# EAGLE design Sensor Board (EAGLE 9.6.2)
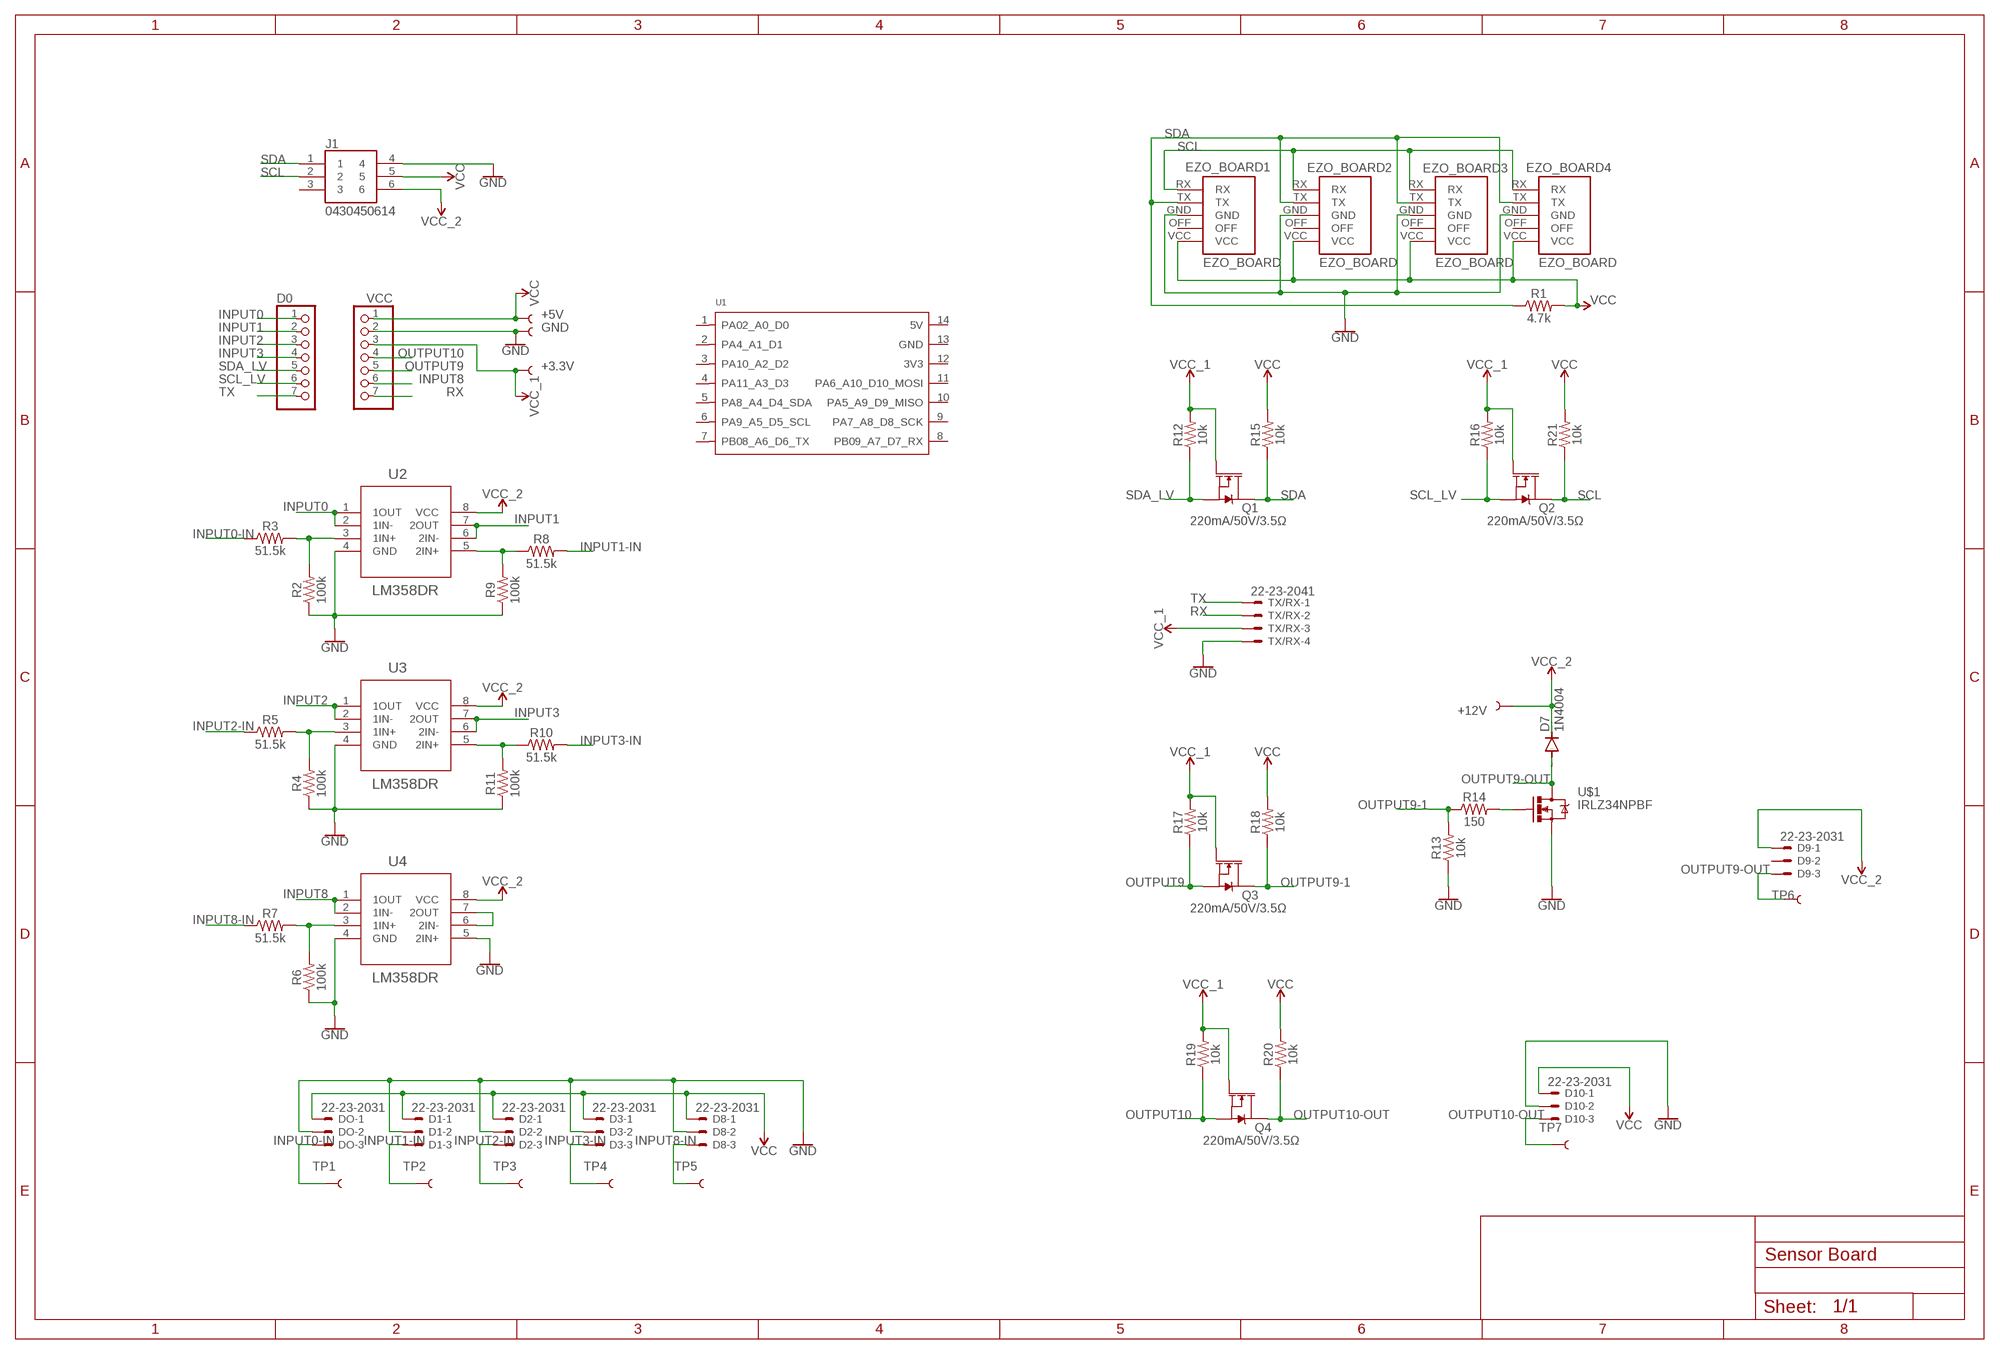
[diagram p0: schematic, sheet 1]

## Parts
+3.3V  TEST-POINTPOGO_PTH  [1X01_NO_SILK]
+5V  TEST-POINTPOGO_PTH  [1X01_NO_SILK]
+12V  TEST-POINTPOGO_PTH  [1X01_NO_SILK]
D0  PINHD-1X7  [1X07]
D1  22-23-2031  [22-23-2031]
D2  22-23-2031  [22-23-2031]
D3  22-23-2031  [22-23-2031]
D7  1N4004  [DO41-10]
D8  22-23-2031  [22-23-2031]
D9  22-23-2031  [22-23-2031]
D10  22-23-2031  [22-23-2031]
DO  22-23-2031  [22-23-2031]
EZO_BOARD1  EZO_BOARD  [EZO_BOARD]
EZO_BOARD2  EZO_BOARD  [EZO_BOARD]
EZO_BOARD3  EZO_BOARD  [EZO_BOARD]
EZO_BOARD4  EZO_BOARD  [EZO_BOARD]
GND  TEST-POINTPOGO_PTH  [1X01_NO_SILK]
J1  0430450614  [MOLEX_0430450614]
Q1  220mA/50V/3.5Ω  MOSFET-NCH-BSS138  [SOT23-3]
Q2  220mA/50V/3.5Ω  MOSFET-NCH-BSS138  [SOT23-3]
Q3  220mA/50V/3.5Ω  MOSFET-NCH-BSS138  [SOT23-3]
Q4  220mA/50V/3.5Ω  MOSFET-NCH-BSS138  [SOT23-3]
R1  4.7k  4.7KOHM-0603-1/10W-1%  [0603]
R2  100k  100KOHM-0603-1/10W-1%  [0603]
R3  51.5k  56KOHM  [0603]
R4  100k  100KOHM-0603-1/10W-1%  [0603]
R5  51.5k  56KOHM  [0603]
R6  100k  100KOHM-0603-1/10W-1%  [0603]
R7  51.5k  56KOHM  [0603]
R8  51.5k  56KOHM  [0603]
R9  100k  100KOHM-0603-1/10W-1%  [0603]
R10  51.5k  56KOHM  [0603]
R11  100k  100KOHM-0603-1/10W-1%  [0603]
R12  10k  10KOHM-0603-1/10W-1%  [0603]
R13  10k  10KOHM-0603-1/10W-1%  [0603]
R14  150  150OHM-0603-1/10W-1%  [0603]
R15  10k  10KOHM-0603-1/10W-1%  [0603]
R16  10k  10KOHM-0603-1/10W-1%  [0603]
R17  10k  10KOHM-0603-1/10W-1%  [0603]
R18  10k  10KOHM-0603-1/10W-1%  [0603]
R19  10k  10KOHM-0603-1/10W-1%  [0603]
R20  10k  10KOHM-0603-1/10W-1%  [0603]
R21  10k  10KOHM-0603-1/10W-1%  [0603]
TP1  TEST-POINT2  [PAD.02X.02]
TP2  TEST-POINT2  [PAD.02X.02]
TP3  TEST-POINT2  [PAD.02X.02]
TP4  TEST-POINT2  [PAD.02X.02]
TP5  TEST-POINT2  [PAD.02X.02]
TP6  TEST-POINT2  [PAD.02X.02]
TP7  TEST-POINT2  [PAD.02X.02]
TX/RX  22-23-2041  [22-23-2041]
U1  MOUDLE-SEEEDUINO-XIAO  [MOUDLE14P-2.54-21X17.8MM]
U2  LM358DR  [D8]
U3  LM358DR  [D8]
U4  LM358DR  [D8]
U$1  IRLZ34NPBF  [TO-220(2)]
VCC  PINHD-1X7  [1X07]

## Nets
GND: D1.2 D2.2 D3.2 D8.2 D10.2 DO.2 EZO_BOARD1.GND EZO_BOARD2.GND EZO_BOARD3.GND EZO_BOARD4.GND GND.1 J1.4 R2.1 R4.1 R6.1 R9.1 R11.1 R13.1 TX/RX.4 U2.4(GND) U3.4(GND) U4.4(GND) U4.5(2IN+) U$1.OUT(S) VCC.2
INPUT0: D0.1 U2.1(1OUT) U2.2(1IN-)
INPUT0-IN: DO.3 R3.1 TP1.1
INPUT1: D0.2 U2.6(2IN-) U2.7(2OUT)
INPUT1-IN: D1.3 R8.2 TP2.1
INPUT2: D0.3 U3.1(1OUT) U3.2(1IN-)
INPUT2-IN: D2.3 R5.1 TP3.1
INPUT3: D0.4 U3.6(2IN-) U3.7(2OUT)
INPUT3-IN: D3.3 R10.2 TP4.1
INPUT8: U4.1(1OUT) U4.2(1IN-) VCC.6
INPUT8-IN: D8.3 R7.1 TP5.1
N$1: R2.2 R3.2 U2.3(1IN+)
N$2: R4.2 R5.2 U3.3(1IN+)
N$3: R6.2 R7.2 U4.3(1IN+)
N$4: R8.1 R9.2 U2.5(2IN+)
N$6: U4.6(2IN-) U4.7(2OUT)
N$7: R10.1 R11.2 U3.5(2IN+)
N$11: R14.2 U$1.IN(G)
OUTPUT9: Q3.2(S) R17.1 VCC.5
OUTPUT9-1: Q3.3(D) R13.2 R14.1 R18.1
OUTPUT9-OUT: D7.A D9.3 TP6.1 U$1.GND(D)
OUTPUT10: Q4.2(S) R19.1 VCC.4
OUTPUT10-OUT: D10.3 Q4.3(D) R20.1 TP7.1
RX: TX/RX.2 VCC.7
SCL: EZO_BOARD1.RX EZO_BOARD2.RX EZO_BOARD3.RX EZO_BOARD4.RX J1.2 Q2.3(D) R21.1
SCL_LV: D0.6 Q2.2(S) R16.1
SDA: EZO_BOARD1.TX EZO_BOARD2.TX EZO_BOARD3.TX EZO_BOARD4.TX J1.1 Q1.3(D) R1.1 R15.1
SDA_LV: D0.5 Q1.2(S) R12.1
TX: D0.7 TX/RX.1
VCC: +5V.1 D1.1 D2.1 D3.1 D8.1 D10.1 DO.1 EZO_BOARD1.VCC EZO_BOARD2.VCC EZO_BOARD3.VCC EZO_BOARD4.VCC J1.5 R1.2 R15.2 R18.2 R20.2 R21.2 VCC.1
VCC_1: +3.3V.1 Q1.1(G) Q2.1(G) Q3.1(G) Q4.1(G) R12.2 R16.2 R17.2 R19.2 TX/RX.3 VCC.3
VCC_2: +12V.1 D7.C D9.1 J1.6 U2.8(VCC) U3.8(VCC) U4.8(VCC)
Unconnected: D9.2 EZO_BOARD1.OFF EZO_BOARD2.OFF EZO_BOARD3.OFF EZO_BOARD4.OFF J1.3 U1.1(PA02_A0_D0) U1.2(PA4_A1_D1) U1.3(PA10_A2_D2) U1.4(PA11_A3_D3) U1.5(PA8_A4_D4_SDA) U1.6(PA9_A5_D5_SCL) U1.7(PB08_A6_D6_TX) U1.8(PB09_A7_D7_RX) U1.9(PA7_A8_D8_SCK) U1.10(PA5_A9_D9_MISO) U1.11(PA6_A10_D10_MOSI) U1.12(3V3) U1.13(GND) U1.14(5V)

## Library data of the parts
+3.3V +5V +12V GND TP1-TP7 = SparkFun-Connectors:TEST-POINT: SparkFun Test Points Bare copper test points for troubleshooting or In-Circuit-Testing. These are used by our Production team for verifying production board runs using pogo-pins on test beds. SparkFun Products: SparkFun LSM9DS1 Breakout <https://www.sparkfun.com/products/13284> SparkFun PSOC <https://www.sparkfun.com/products/13714> SparkFun Load Cell Amplifier <https://www.sparkfun.com/products/13879>
D0 VCC = pinhead:PINHD-1X7: PIN HEADER
D1-D3 D8-D10 DO = con-molex:22-23-2031: .100" (2.54mm) Center Header - 3 Pin; MF: MOLEX; MPN: 22-23-2031; OC_FARNELL: 1462950; OC_NEWARK: 30C0862
D7 = diode:1N4004: DIODE general purpose rectifier, 1 A
EZO_BOARD1-EZO_BOARD4 = EZO Board Atlas Scientific:EZO_BOARD
J1 = 0430450614:0430450614: Conn Power HDR 6 POS 3mm Solder ST Thru-Hole 6 Terminal 1 Port Micro-Fit 3.0Ã¢â¢ Tray; AVAILABILITY: Unavailable; DESCRIPTION: Connector Header Through Hole 6 position 0.118 _3.00mm_; MF: Molex; MP: 0430450614; PACKAGE: None; PRICE: None
Q1-Q4 = SparkFun-DiscreteSemi:MOSFET-NCH: N-channel MOSFETs Voltage controlled devices that allow control of high current outputs. SparkFun Products: SparkFun OpenScale <https://www.sparkfun.com/products/13261> SparkFun Digital Sandbox <https://www.sparkfun.com/products/12651> SparkFun Monster Moto Shield <https://www.sparkfun.com/products/10182> SparkFun MOSFET Power Controller <https://www.sparkfun.com/products/11214>; PROD_ID: TRANS-00830
R1 = SparkFun-Resistors:4.7KOHM: 4.7kΩ resistor A resistor is a passive two-terminal electrical component that implements electrical resistance as a circuit element. Resistors act to reduce current flow, and, at the same time, act to lower voltage levels within circuits. - Wikipedia; PROD_ID: RES-07857
R2 R4 R6 R9 R11 = SparkFun-Resistors:100KOHM: 100kΩ resistor A resistor is a passive two-terminal electrical component that implements electrical resistance as a circuit element. Resistors act to reduce current flow, and, at the same time, act to lower voltage levels within circuits. - Wikipedia; PROD_ID: RES-07828
R3 R5 R7 R8 R10 = SparkFun-Resistors:56KOHM; VALUE: 56k
R12 R13 R15-R21 = SparkFun-Resistors:10KOHM: 10kΩ resistor A resistor is a passive two-terminal electrical component that implements electrical resistance as a circuit element. Resistors act to reduce current flow, and, at the same time, act to lower voltage levels within circuits. - Wikipedia; PROD_ID: RES-00824
R14 = SparkFun-Resistors:150OHM: 150Ω resistor A resistor is a passive two-terminal electrical component that implements electrical resistance as a circuit element. Resistors act to reduce current flow, and, at the same time, act to lower voltage levels within circuits. - Wikipedia; PROD_ID: RES-11028
TX/RX = con-molex:22-23-2041: .100" (2.54mm) Center Header - 4 Pin; MF: MOLEX; MPN: 22-23-2041; OC_FARNELL: 1462920; OC_NEWARK: 38C0355
U1 = Seeeduino XIAO:MOUDLE-SEEEDUINO-XIAO
U2-U4 = LM358DR:LM358DR; BUILT_BY: EMA_UL_Team; MANUFACTURER: Texas Instruments; MANUFACTURER_PART_NUMBER: LM358DR; VENDOR: Vendor
U$1 = IRLZ34NPBF:IRLZ34NPBF; DESCRIPTION: N-Channel 55V 30A _Tc_ 68W _Tc_ Through Hole TO-220AB; DIGI-KEY_PART_NUMBER: IRLZ34NPBF-ND; MF: Infineon Technologies; MP: IRLZ34NPBF; PACKAGE: TO-220 Infineon

## Board
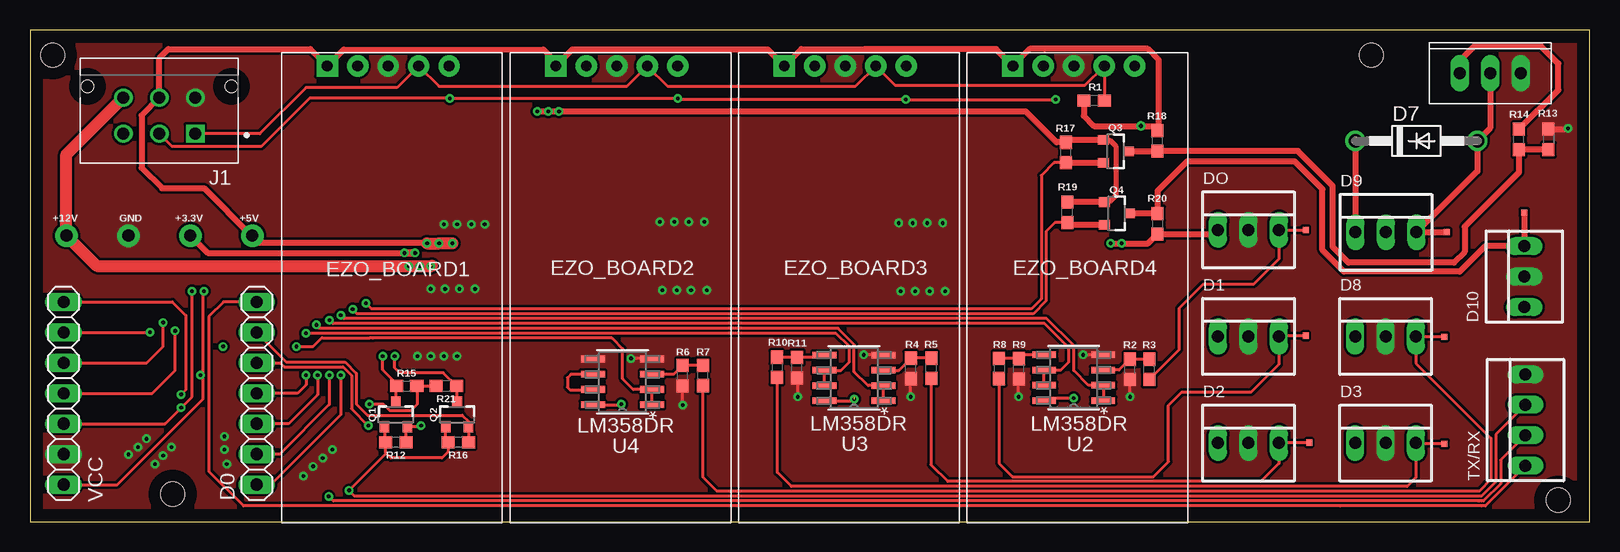
[diagram p1: board, top side]
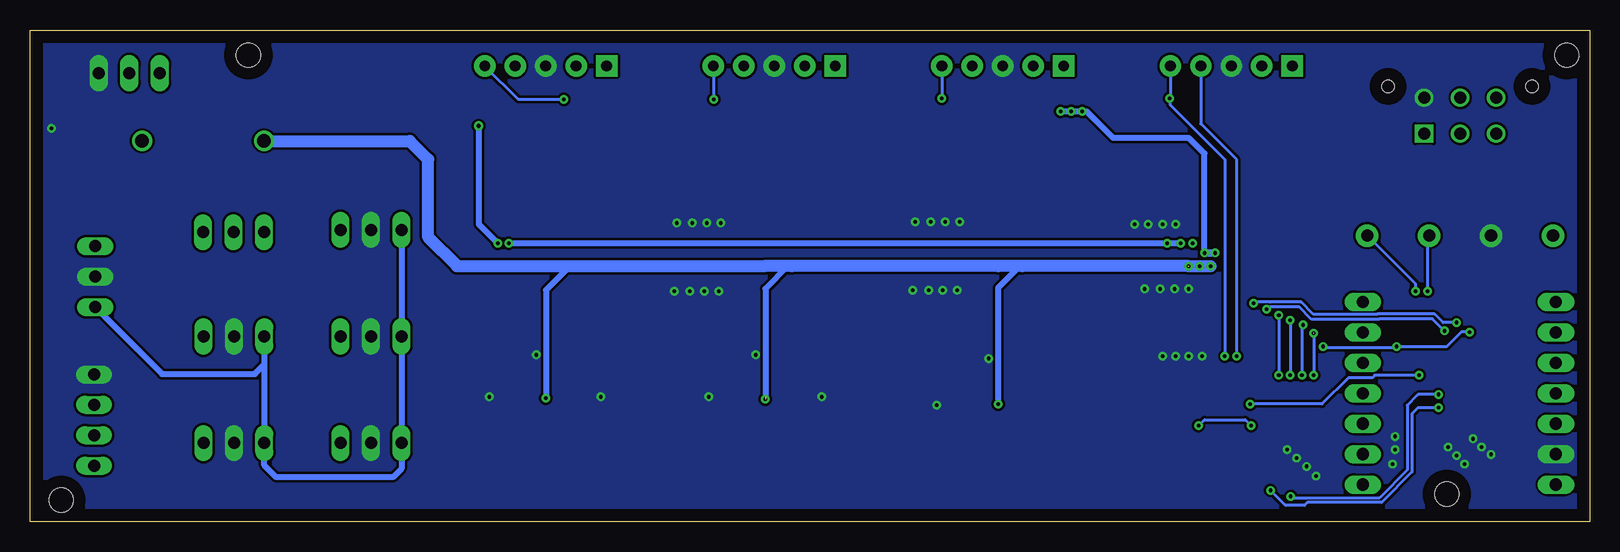
[diagram p2: board, bottom side, seen from below]

Size 130 x 41 mm. Coordinates in mm from the lower left corner, seen from the top.
Outline: 0,0 130,0 130,41 0,41 0,0
Copper layers (1*16): Top 0.035mm / dielectric 1.5mm / Bottom 0.035mm
Design rules "default *": minimum track width 6mil, minimum drill 0.35mm, track to track 6mil, track to pad 6mil, pad to pad 6mil, via to via 6mil, smd to smd 6mil, copper to edge 40mil, drill to drill 6mil, minimum pad ring 10mil, minimum via ring 8mil, stop-mask expansion 4mil, vias tented up to drill 0.3mm, thermal gap 10mil
Holes 2 mm at 1.9,38.9 11.9,2.3 127.4,1.8 111.8,38.9

### Footprints (pad centres in the part's own frame; a part is rotated, then mirrored left to right if it is on the bottom)
1X01_NO_SILK = drill 1.016 pad 1.88: 1 0,0
1X07 = drill 1.016 long: 1 -7.62,0; 2 -5.08,0; 3 -2.54,0; 4 0,0; 5 2.54,0; 6 5.08,0; 7 7.62,0
22-23-2031 = drill 1 long: 1 -2.54,0; 2 0,0; 3 2.54,0
DO41-10 = drill 1.118: A 5.08,0; C -5.08,0
EZO_BOARD = drill 0.9 pad 1.778: GND 8.89,38.1; OFF 6.35,38.1; RX 13.97,38.1; TX 11.43,38.1 | drill 0.9 pad 1.778 square: VCC 3.81,38.1
MOLEX_0430450614 = drill 1.02 square: 1 -3,1.5 | drill 1.02: 2 0,1.5; 3 3,1.5; 4 -3,-1.5; 5 0,-1.5; 6 3,-1.5 | hole 1.02: 6,-2.44; -6,-2.44
SOT23-3 = smd 0.8 x 0.9: 1 -0.95,-1; 2 0.95,-1; 3 0,1.1
0603 = smd 1.1 x 1: 1 -0.85,0; 2 0.85,0
PAD.02X.02 = smd 0.508 x 0.508: 1 0,0
22-23-2041 = drill 1 long: 1 -3.81,0; 2 -1.27,0; 3 1.27,0; 4 3.81,0
MOUDLE14P-2.54-21X17.8MM = smd 2.75 x 2: 1 0.835,18.12; 2 0.835,15.58; 3 0.835,13.04; 4 0.835,10.5; 5 0.835,7.96; 6 0.835,5.42; 7 0.835,2.88; 8 17,2.88; 9 17,5.42; 10 17,7.96; 11 17,10.5; 12 17,13.04; 13 17,15.58; 14 17,18.12
D8 = smd 1.981 x 0.559: 1 -2.464,1.905; 2 -2.464,0.635; 3 -2.464,-0.635; 4 -2.464,-1.905; 5 2.464,-1.905; 6 2.464,-0.635; 7 2.464,0.635; 8 2.464,1.905
TO-220(2) = drill 1.016 long: GND 0,0; IN -2.54,0; OUT 2.54,0

### Placement (x,y rotation side)
+3.3V  13.37,23.85 0 top
+5V  18.53,23.85 0 top
+12V  3.04,23.85 0 top
D0  18.9,10.7 90 top
D1  101.57,15.44 0 top
D2  101.57,6.55 0 top
D3  113,6.55 0 top
D7  115.57,31.75 0 top
D8  113,15.44 0 top
D9  113.03,24.13 0 top
D10  124.56,20.42 90 top
DO  101.57,24.33 0 top
EZO_BOARD1  59.07,-0.1 0 top
EZO_BOARD2  20.97,-0.1 0 top
EZO_BOARD3  40.02,-0.1 0 top
EZO_BOARD4  78.12,-0.1 0 top
GND  8.2,23.85 0 top
J1  10.78,33.85 180 top
Q1  30.5,8.9 0 top
Q2  35.6,8.9 0 top
Q3  90.47,30.88 270 top
Q4  90.57,25.7 270 top
R1  88.7,35.1 180 top
R2  91.7,12.7 90 top
R3  93.3,12.7 90 top
R4  73.43,12.77 90 top
R5  75.13,12.78 90 top
R6  54.4,12.17 90 top
R7  56.1,12.18 90 top
R8  80.79,12.76 270 top
R9  82.42,12.74 90 top
R10  62.27,12.86 270 top
R11  63.94,12.84 90 top
R12  30.5,6.6 180 top
R13  126.58,31.87 270 top
R14  124.12,31.87 90 top
R15  31.4,11.3 0 top
R16  35.7,6.6 180 top
R17  86.36,30.78 90 top
R18  93.98,31.75 90 top
R19  86.46,25.8 90 top
R20  93.98,24.83 270 top
R21  34.7,11.3 180 top
TP1  106.34,24.32 0 top
TP2  106.34,15.5 0 top
TP3  106.64,6.58 0 top
TP4  117.9,6.48 0 top
TP5  117.9,15.4 0 top
TP6  118.11,24.13 0 top
TP7  124.56,25.77 0 top
TX/RX  124.66,8.46 90 top
U1  19.2,-6.66 180 top  (outside the outline)
U2  87,12 180 top
U3  68.69,11.98 180 top
U4  49.39,11.65 180 top
U$1  121.72,37.4 0 top
VCC  2.8,10.7 90 top

### Tracks (layer width: path | path; a pad name or v marks a point on that pad's centre or on a via)
GND  (via drill 0.3)
  Top 0.254: U4.4 51.81,13.6 v50.1,13.6 | U3.4 69.52,13.88 v69.5,13.9 | v87.8,13.9 v87.81,13.9 U2.4 | v54.4,9.7 R6.1 | v64,10.4 64,11.93 R11.1 | v73.4,10.4 73.4,11.89 R4.1 | v91.7,10.4 R2.1 | v82.4,10.4 82.4,11.87 R9.1
  Top 0.508: R13.1 128.12,32.72 v128.2,32.8
  other vias: 8.2,5.6 9,6.2 9.7,6.9 11.8,6.2 11.1,5.5 10.4,4.8 16.2,7.1 16.2,6 16.4,4.8 22.8,3.8 23.6,4.6 24.4,5.3 25.2,6 33.4,19.4 34.6,19.4 35.8,19.4 37.1,19.4 34.5,24.8 35.6,24.8 36.8,24.8 37.9,24.8 32.3,13.8 33.4,13.8 34.5,13.8 35.6,13.8 52.5,25 53.7,25 54.9,25 56.2,25 52.7,19.3 53.9,19.3 55.1,19.3 56.4,19.3 72.4,24.9 73.6,24.9 74.8,24.9 76.1,24.9 72.6,19.2 73.8,19.2 75,19.2 76.3,19.2
  pour Top (isolate 0.2, no thermals): 0.9,43.2 -1.4,40.9 -1.4,-0.8 -0.7,-1.5 131.4,-1.5 132.9,0 132.9,40.1 130.4,42.6 121.4,42.6
  pour Bottom (isolate 0.2, no thermals): 2.2,44.4 1.6,44.4 -2.7,40.1 -2.7,-1.6 -1.7,-2.6 134.3,-2.6 134.3,40.42 130.72,44 3.29,43.31
INPUT0  (via drill 0.3)
  Top 0.254: U2.1 U2.2 88.23,11.37 87,12.6 87,14.67 84.74,16.93 26.17,16.93 v25.9,17.2 | v25.9,12.2 25.9,8.9 20.08,3.08 D0.1
  Bottom 0.254: v25.9,17.2 v25.9,12.2
INPUT0-IN
  Top 0.254: TP1.1 DO.3 104.11,21.91 102,19.8 97.8,19.8 95.8,17.8 95.8,14.35 R3.1
INPUT1  (via drill 0.3)
  Top 0.254: U2.7 U2.6 85.93,12.63 86.59,13.3 86.59,14.5 84.57,16.52 25.23,16.52 v24.95,16.8 | D0.2 20.82,5.62 24.95,9.75 v24.95,12.2
  Bottom 0.254: v24.95,16.8 v24.95,12.2
INPUT1-IN
  Top 0.254: TP2.1 104.17,15.5 D1.3 104.11,13.11 101.8,10.8 96.5,10.8 96,10.8 94.9,9.7 94.9,5 93.65,3.75 81.9,3.75 80.79,4.86 R8.2
INPUT2  (via drill 0.3)
  Top 0.254: U3.1 U3.2 69.86,11.35 68.7,12.5 68.7,14.77 67.36,16.11 24.16,16.11 v23.88,16.4 | D0.3 21.56,8.16 23.98,10.58 v23.98,12.2
  Bottom 0.254: v23.88,16.4 23.98,16.3 v23.98,12.2
INPUT2-IN
  Top 0.254: TP3.1 104.14,6.58 D2.3 104.11,4.85 102.6,3.34 76.5,3.34 75.1,4.74 75.1,11.9 R5.1
INPUT3  (via drill 0.3)  (1 unrouted)
  Top 0.254: U3.7 U3.6 67.61,12.62 68.29,13.3 68.29,14.6 67.19,15.71 v23.01,15.71 | D0.4 22.3,10.7 23,11.4 v23,12.2
  Bottom 0.254: v23,15.7 v23,12.2
INPUT3-IN
  Top 0.254: TP4.1 115.61,6.48 D3.3 115.54,3.67 114.81,2.94 63.46,2.94 62.3,4.1 62.3,11.98 R10.2
INPUT8  (via drill 0.3)
  Top 0.254: U4.1 U4.2 50.28,11.02 49.4,11.9 49.4,14.4 48.5,15.3 28.6,15.3 28.3,15.3 24.4,15.3 24.3,15.3 23.6,14.6 v22.2,14.6 | VCC.6 9.98,15.78 v10,15.8
  Bottom 0.254: v10,15.8 10.7,15.8 11.9,14.6 v16.1,14.6 16.16,14.54 22.14,14.54 v22.2,14.6
INPUT8-IN
  Top 0.254: TP5.1 115.58,15.4 D8.3 115.54,13.2 121.79,6.95 121.79,3.5 120.82,2.53 120.5,2.53 | 120.5,2.53 | R7.1 56.1,3.7 57.27,2.53 120.5,2.53
N$1
  Top 0.254: 89.48,12.65 U2.3 90.78,12.63 R2.2 R3.2
N$2
  Top 0.254: R5.2 R4.2 72.42,12.62 U3.3
N$3
  Top 0.254: R7.2 R6.2 53.66,12.29 U4.3
N$4
  Top 0.254: U2.5 82.73,13.9 R9.2 80.81,13.59 R8.1
N$6
  Top 0.254: U4.6 45.09,12.29 44.8,12 44.8,11.2 45,11 46.91,11 U4.7
N$7
  Top 0.254: U3.5 66.03,13.69 R11.2 62.29,13.69 R10.1
N$11
  Top 0.508: R14.2 127.4,36 127.4,38.2 125.95,39.65 120.4,39.65 119.18,38.43 U$1.IN
OUTPUT9  (via drill 0.3)
  Top 0.254: R17.1 85.36,29.93 84.29,28.86 84.29,18.57 83.46,17.74 28.46,17.74 v28,18.2 | VCC.5 9.74,13.24 11.1,14.6 v11.1,16.6
  Top 0.508: R17.1 Q3.2
  Bottom 0.254: v11.1,16.6 12.2,16.6 12.91,17.31 17.68,17.31 17.71,17.28 23,17.28 24.03,18.31 26.61,18.31 26.64,18.33 27.87,18.33 v28,18.2
OUTPUT9-1
  Top 0.508: R13.2 R14.1 124.12,29.12 119.6,24.6 119.6,22.5 118.7,21.6 109.9,21.6 108.6,22.9 108.6,28 105.7,30.9 94.3,30.9 | 94.3,30.9 R18.1 | Q3.3 94.28,30.88 94.3,30.9
OUTPUT9-OUT
  Top 0.508: U$1.GND 121.72,32.82 D7.A 120.65,29.21 D9.3 TP6.1
OUTPUT10  (via drill 0.3)
  Top 0.254: R19.1 85.45,24.95 84.7,24.2 84.7,18.4 83.63,17.33 27.27,17.33 v26.9,17.7 | VCC.4 10.2,10.7 12.1,12.6 v12.1,15.9
  Top 0.508: Q4.2 86.66,24.75 R19.1
  Bottom 0.254: v12.1,15.9 13.1,16.9 17.51,16.9 17.54,16.87 23.17,16.87 24.2,17.9 26.7,17.9 v26.9,17.7
OUTPUT10-OUT
  Top 0.508: TP7.1 D10.3 121.29,22.96 119.17,20.84 109.53,20.84 107.74,22.63 107.74,27.73 105.43,30.04 96.44,30.04 93.98,27.58 R20.1 93.96,25.7 Q4.3
RX  (via drill 0.3)
  Top 0.254: TX/RX.2 122.6,5.13 122.6,3.17 121.15,1.72 121,1.72 120.83,1.72 120.72,1.72 25.28,1.72 v24.9,2.1 | VCC.7 11.87,18.32 12.99,17.2 12.99,10.99 v12.6,10.6
  Bottom 0.254: v12.6,10.6 14.3,10.6 15.2,9.7 15.2,4.3 17.5,2 24.8,2 v24.9,2.1
SCL  (via drill 0.3)
  Top 0.254: J1.2 11.83,31.3 19.3,31.3 23.3,35.3 v35,35.3 v54,35.3 54.1,35.2 v73,35.2 v85.5,35.2 | v30.4,13.8 30.4,12.8 30.8,12.4 34.45,12.4 R21.1 35.6,11.25 Q2.3
  Bottom 0.254: v85.5,35.2 89.29,35.2 EZO_BOARD4.RX | EZO_BOARD1.RX 73.04,35.24 v73,35.2 | EZO_BOARD3.RX v53.99,35.31 v54,35.3 | EZO_BOARD2.RX 34.94,35.36 | 34.94,35.36 v35,35.3 | v30.4,13.8 30.4,30.2 34.94,34.74 34.94,35.36
SCL_LV
  Top 0.254: R16.1 Q2.2 36.55,8.35 36.04,8.86 28.14,8.86 27.21,9.79 27.21,12.37 26.27,13.31 21.37,13.31 D0.6
SDA  (via drill 0.3)
  Top 0.254: R1.1 EZO_BOARD4.TX 87.95,36.4 72.1,36.4 EZO_BOARD1.TX 68.8,36.3 53.15,36.3 EZO_BOARD3.TX 49.75,36.3 34.1,36.3 EZO_BOARD2.TX 30.6,36.2 23,36.2 19.15,32.35 J1.1 | v29.4,13.8 29.4,12.65 30.55,11.5 R15.1 30.5,11.25 Q1.3
  Bottom 0.254: EZO_BOARD2.TX 32.4,33.17 29.4,30.18 v29.4,13.8
SDA_LV  (via drill 0.3)
  Top 0.254: R12.1 31.35,7.8 Q1.2 32.5,7.9 v32.6,8 | D0.5 20.86,13.24 21.2,12.9 26.1,12.9 26.8,12.2 26.8,9.4 v28.2,8
  Bottom 0.254: v28.2,8 28.7,8.5 32.1,8.5 v32.6,8
TX
  Top 0.254: TX/RX.1 121.32,1.31 121,1.31 109.2,1.3 17.8,1.3 14.91,4.2 14.91,17.1 16.13,18.32 D0.7
VCC  (via drill 0.3, 0.35)
  Top 0.254: VCC.1 7.28,3.08 14.4,10.2 14.4,12.4 | v14.5,19.2 14.4,19.1 14.4,12.4 | 14.4,11.7 14.4,12 v14.2,12.2 14.4,12.4 | v28.3,9.8 29.45,9.8 29.98,9.27 31.77,9.27 32.3,9.8 32.3,11.25 R15.2 R21.2
  Top 0.508: 69.6,39.41 64.28,39.4 EZO_BOARD1.VCC 61.49,39.39 45.22,39.39 EZO_BOARD3.VCC 43.83,38.36 42.8,39.39 26.15,39.37 EZO_BOARD2.VCC 23.38,39.4 11.54,39.4 10.78,38.64 J1.5 9.3,33.87 9.3,29.5 11,27.8 14.5,27.8 18.45,23.85 +5V.1 19.12,23.26 33.04,23.26 v33.1,23.2 | 69.6,39.41 80.52,39.41 EZO_BOARD4.VCC 83.35,39.42 84.6,39.42 | 69.6,39.41 | R18.2 94.1,32.72 94.1,33 | 94.1,33 94.1,38.5 93.18,39.42 84.6,39.42 | 84.6,39.42 | R1.2 87.85,33.85 88.7,33 v92.6,33 94.1,33 | v90.1,23.2 v91,23.2 93.2,23.2 R20.2 98.68,23.98 DO.1
  Top 1.016: v33.1,23.2 v34.1,23.2 v35.2,23.2
  Bottom 0.254: v14.5,19.2 14.5,19.82 +5V.1 | v14.2,12.2 17.7,12.2 17.71,12.2 17.9,12.2 18.1,12 20.1,12 22.3,9.8 v28.3,9.8
  Bottom 0.508: DO.1 D1.1 D2.1 99.03,4.4 99.73,3.7 109.46,3.7 110.46,4.7 D3.1 110.46,13.1 | D8.1 110.46,13.1 | 110.46,13.1 111.26,12.3 118.98,12.3 D10.1 | v34.1,23.2 v90.1,23.2 | v92.6,33 92.6,24.8 v91,23.2
VCC_1  (via drill 0.3)
  Top 0.254: TX/RX.3 122.19,7.26 122.19,3.33 120.98,2.12 120.66,2.12 | 120.66,2.12 | 120.66,2.12 27.08,2.12 v26.6,2.6 29.7,5.7 | VCC.3 11.26,8.16 v12.6,9.5 13.5,10.4 v13.5,19.2 | Q2.1 34.65,6.8 R16.2 34.85,5.8 34.35,5.3 30.1,5.3 29.7,5.7 | Q1.1 29.55,6.7 R12.2 29.65,5.75 29.7,5.7
  Top 0.406: Q3.1 89.5,31.8 90,31.8 90.5,31.3 90.5,27.18 89.97,26.65 Q4.1
  Top 0.508: Q4.1 R19.2 | Q3.1 86.56,31.83 R17.2 85.57,31.63 83,34.2 v44.1,34.2 v43.2,34.2 v42.3,34.2 | +3.3V.1 14.82,22.4 v31.2,22.4
  Top 0.61: v32.1,22.4 v31.2,22.4
  Bottom 0.254: v13.5,19.2 13.5,23.72 +3.3V.1 | v12.6,9.5 14.29,9.5 14.79,9 14.79,4.13 17.33,1.59 23.51,1.59 23.76,1.34 25.34,1.34 v26.6,2.6
  Bottom 0.508: 44,34.2 v43.2,34.2 v42.3,34.2 41.9,34.2 39.7,32 33.4,32 32.1,30.7 v32.1,22.4
  Bottom 0.61: v32.1,22.4 v31.2,22.4
VCC_2  (via drill 0.3)  (2 unrouted)
  Top 0.254: U2.8 84.74,10.3 v87,10.3 | U4.8 49.24,9.74 v49.3,9.8 | U3.8 68.58,10.07 v68.7,10.2
  Top 0.508: D7.C D9.1
  Top 1.016: 33.5,21.31 5.58,21.31 +12V.1 3.04,30.61 J1.6
  Bottom 0.508: 49.3,9.7 v49.3,9.8 49.3,19.5 47.5,21.3 47.3,21.3 | 68.8,21.3 68.7,21.2 | 68.7,10.4 68.7,19.4 66.8,21.3 66.5,21.3 | 87.2,21.3 87,21.1 | v87,10.3 87,19.3 85,21.3
  Bottom 1.016: D7.C 98.35,31.75 96.8,30.2 96.8,23.7 94.4,21.3 87.2,21.3 85,21.3 68.8,21.3 66.5,21.3 49.3,21.3 47.3,21.3 v33.4,21.3 v32.5,21.3 v31.6,21.3